# EAGLE design z80_test (EAGLE 6.5.0)
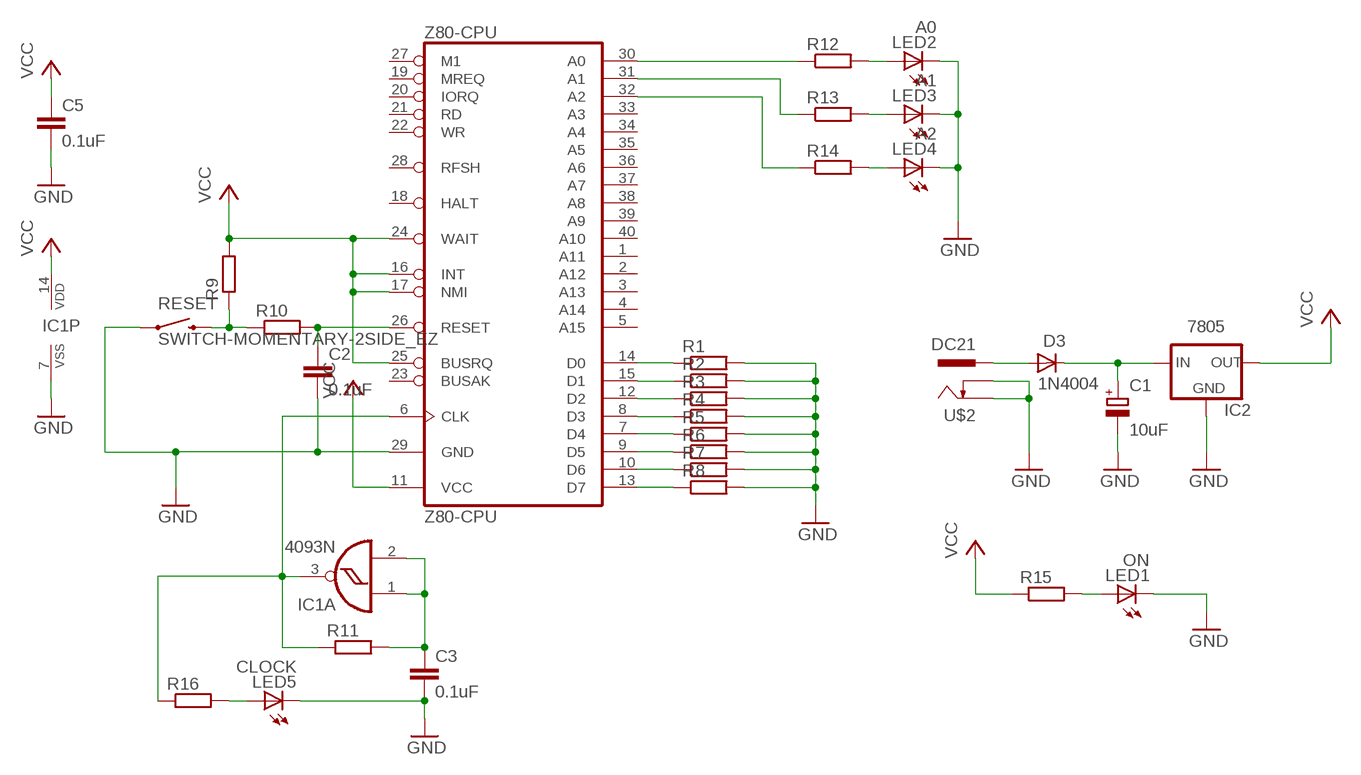
[diagram p0: schematic, sheet 1]

## Parts
C1  10uF  CPOL-EUE2,5-6E  [E2,5-6E]
C2  0.1uF  C-EU025-025X050  [C025-025X050]
C3  0.1uF  C-EU025-025X050  [C025-025X050]
C5  0.1uF  C-EU025-025X050  [C025-025X050]
D3  1N4004  [DO41-10]
IC1  4093N  [DIL14]
IC2  7805  78XXL  [78XXL]
LED1  ON  LED3MM  [LED3MM]
LED2  A0  LED3MM  [LED3MM]
LED3  A1  LED3MM  [LED3MM]
LED4  A2  LED3MM  [LED3MM]
LED5  CLOCK  LED3MM  [LED3MM]
R1  10K  R-EU_0204/7  [0204/7]
R2  10K  R-EU_0204/7  [0204/7]
R3  10K  R-EU_0204/7  [0204/7]
R4  10K  R-EU_0204/7  [0204/7]
R5  10K  R-EU_0204/7  [0204/7]
R6  10K  R-EU_0204/7  [0204/7]
R7  10K  R-EU_0204/7  [0204/7]
R8  10K  R-EU_0204/7  [0204/7]
R9  10K  R-EU_0204/7  [0204/7]
R10  330  R-EU_0204/7  [0204/7]
R11  68K  R-EU_0204/7  [0204/7]
R12  470  R-EU_0204/7  [0204/7]
R13  470  R-EU_0204/7  [0204/7]
R14  470  R-EU_0204/7  [0204/7]
R15  470  R-EU_0204/7  [0204/7]
R16  470  R-EU_0204/7  [0204/7]
RESET  SWITCH-MOMENTARY-2SIDE_EZ  [TACTILE-PTH-SIDEEZ]
U$2  DC21  [DCSKT]
Z80-CPU  Z80-CPU  Z80CPU  [DIL40]

## Nets
+VRAW [VCC]: C1.+ D3.C IC2.IN
GND [GND]: C1.- C2.2 C3.2 C5.2 IC1.7(P:VSS) IC2.GND LED1.K(C) LED2.K(C) LED3.K(C) LED4.K(C) LED5.K(C) R1.2 R2.2 R3.2 R4.2 R5.2 R6.2 R7.2 R8.2 RESET.1 U$2.2 U$2.3 Z80-CPU.29(GND)
N$1: R12.1 Z80-CPU.30(A0)
N$2: R13.1 Z80-CPU.31(A1)
N$3: R14.1 Z80-CPU.32(A2)
N$4: R1.1 Z80-CPU.14(D0)
N$5: R2.1 Z80-CPU.15(D1)
N$6: R3.1 Z80-CPU.12(D2)
N$7: R4.1 Z80-CPU.8(D3)
N$8: R5.1 Z80-CPU.7(D4)
N$9: R6.1 Z80-CPU.9(D5)
N$10: R7.1 Z80-CPU.10(D6)
N$11: R8.1 Z80-CPU.13(D7)
N$12 [VCC]: D3.A U$2.1
N$13: C2.1 R10.2 Z80-CPU.26(RESET)
N$14: R9.1 R10.1 RESET.2
N$15: IC1.3(A:O) R11.1 R16.1 Z80-CPU.6(CLK)
N$16: LED2.A R12.2
N$17: LED1.A R15.2
N$18: LED3.A R13.2
N$19 [GND]: C3.1 IC1.1(A:I0) IC1.2(A:I1) R11.2
N$20: LED4.A R14.2
N$21: LED5.A R16.2
VCC [VCC]: C5.1 IC1.14(P:VDD) IC2.OUT R9.2 R15.1 Z80-CPU.11(VCC) Z80-CPU.16(INT) Z80-CPU.17(NMI) Z80-CPU.24(WAIT) Z80-CPU.25(BUSRQ)
Unconnected: IC1.4(B:O) IC1.5(B:I0) IC1.6(B:I1) IC1.8(C:I0) IC1.9(C:I1) IC1.10(C:O) IC1.11(D:O) IC1.12(D:I0) IC1.13(D:I1) Z80-CPU.1(A11) Z80-CPU.2(A12) Z80-CPU.3(A13) Z80-CPU.4(A14) Z80-CPU.5(A15) Z80-CPU.18(HALT) Z80-CPU.19(MREQ) Z80-CPU.20(IORQ) Z80-CPU.21(RD) Z80-CPU.22(WR) Z80-CPU.23(BUSAK) Z80-CPU.27(M1) Z80-CPU.28(RFSH) Z80-CPU.33(A3) Z80-CPU.34(A4) Z80-CPU.35(A5) Z80-CPU.36(A6) Z80-CPU.37(A7) Z80-CPU.38(A8) Z80-CPU.39(A9) Z80-CPU.40(A10)

## Library data of the parts
C1 = rcl:CPOL-EU: POLARIZED CAPACITOR, European symbol
C2 C3 C5 = rcl:C-EU: CAPACITOR, European symbol
D3 = diode:1N4004: DIODE general purpose rectifier, 1 A
IC1 = 40xx:4093: Quad 2-input NAND schmitt trigger
IC2 = v-reg:78XXL: VOLTAGE REGULATOR
LED1-LED5 = led:LED: LED OSRAM: - CHIPLED LG R971, LG N971, LY N971, LG Q971, LY Q971, LO R971, LY R971 LH N974, LH R974 LS Q976, LO Q976, LY Q976 LO Q996 - Hyper CHIPLED LW Q18S LB Q993, LB Q99A, LB R99A - SideLED LS A670, LO A670, LY A670, LG A670, LP A670 LB A673, LV A673, LT A673, LW A673 LH A674 LY A675 LS A676, LA A676, LO A676, LY A676, LW A676 LS A679, LY A679, LG A679 - Hyper Micro SIDELED® LS Y876, LA Y876, LO Y876, LY Y876 LT Y87S - SmartLED LW L88C, LW L88S LB L89C, LB L89S, LG L890 LS L89K, LO L89K, LY L89K LS L896, LA L896, LO L896, LY L896 - TOPLED LS T670, LO T670, LY T670, LG T670, LP T670 LSG T670, LSP T670, LSY T670, LOP T670, LYG T670 LG T671, LOG T671, LSG T671 LB T673, LV T673, LT T673, LW T673 LH T674 LS T676, LA T676, LO T676, LY T676, LB T676, LH T676, LSB T676, LW T676 LB T67C, LV T67C, LT T67C, LS T67K, LO T67K, LY T67K, LW E67C LS E67B, LA E67B, LO E67B, LY E67B, LB E67C, LV E67C, LT E67C LW T67C LS T679, LY T679, LG T679 LS T770, LO T770, LY T770, LG T770, LP T770 LB T773, LV T773, LT T773, LW T773 LH T774 LS E675, LA E675, LY E675, LS T675 LS T776, LA T776, LO T776, LY T776, LB T776 LHGB T686 LT T68C, LB T68C - Hyper Mini TOPLED® LB M676 - Mini TOPLED Santana® LG M470 LS M47K, LO M47K, LY M47K Source: http://www.osram.convergy.de LUXEON: - LUMILED® LXK2-PW12-R00, LXK2-PW12-S00, LXK2-PW14-U00, LXK2-PW14-V00 LXK2-PM12-R00, LXK2-PM12-S00, LXK2-PM14-U00 LXK2-PE12-Q00, LXK2-PE12-R00, LXK2-PE12-S00, LXK2-PE14-T00, LXK2-PE14-U00 LXK2-PB12-K00, LXK2-PB12-L00, LXK2-PB12-M00, LXK2-PB14-N00, LXK2-PB14-P00, LXK2-PB14-Q00 LXK2-PR12-L00, LXK2-PR12-M00, LXK2-PR14-Q00, LXK2-PR14-R00 LXK2-PD12-Q00, LXK2-PD12-R00, LXK2-PD12-S00 LXK2-PH12-R00, LXK2-PH12-S00 LXK2-PL12-P00, LXK2-PL12-Q00, LXK2-PL12-R00 Source: www.luxeon.com KINGBRIGHT: KA-3528ASYC Source: www.kingbright.com
R1-R16 = rcl:R-EU_: RESISTOR, European symbol
RESET = SparkFun-Electromechanical:SWITCH-MOMENTARY-2: Various NO switches- pushbuttons, reed, etc
U$2 = dcsocket:DC21: DC 2.1 mm Power Socket Negative Centre
Z80-CPU = zilog:Z80CPU: Z80 FAMILY DEVICE

## Net classes
0 default: width 0.508 mm, drill 0.508 mm
1 VCC: width 1.016 mm, drill 0.508 mm
2 GND: width 1.016 mm, drill 0.508 mm

## Board
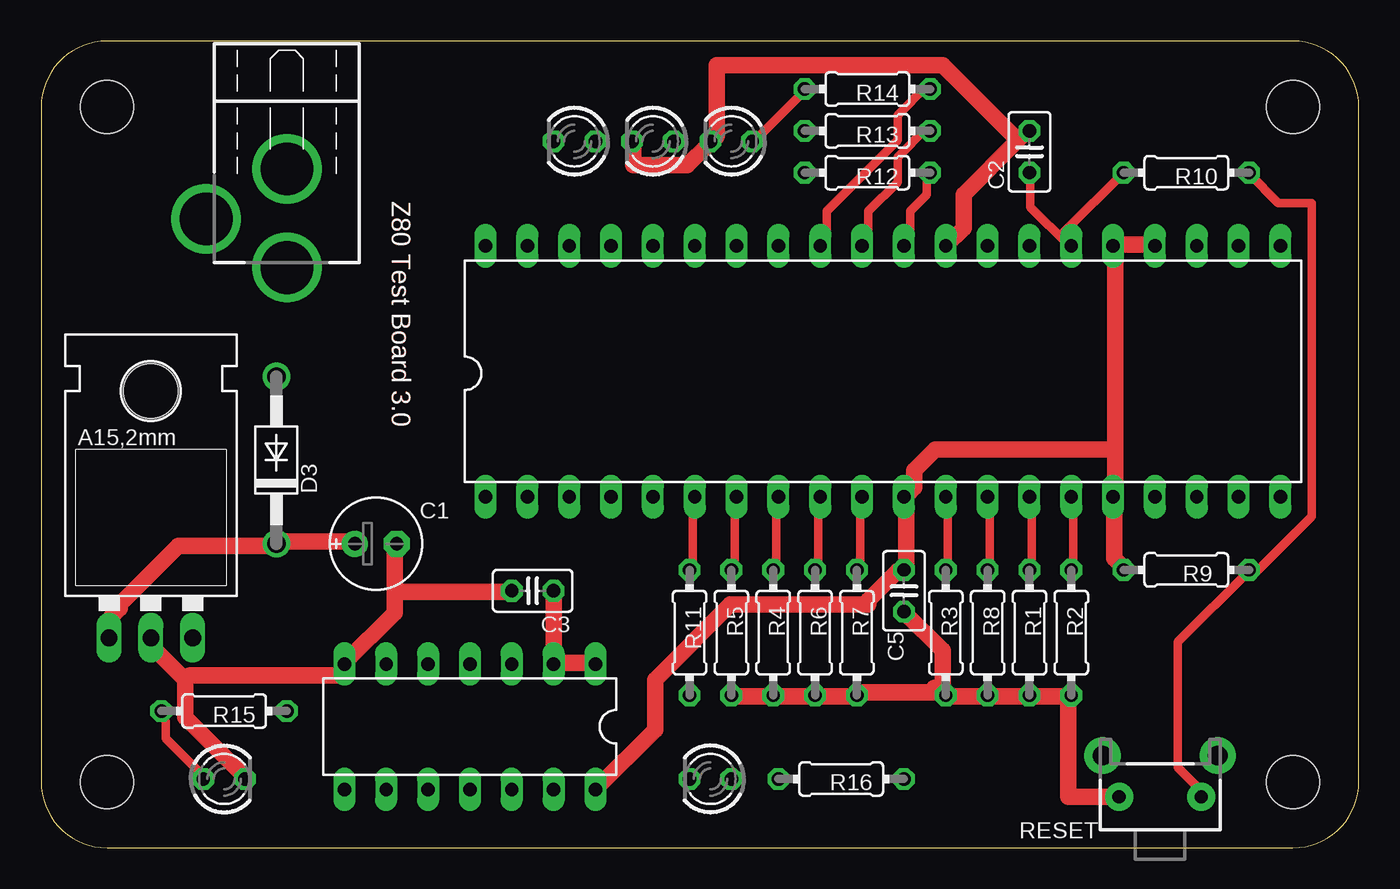
[diagram p1: board, top side]
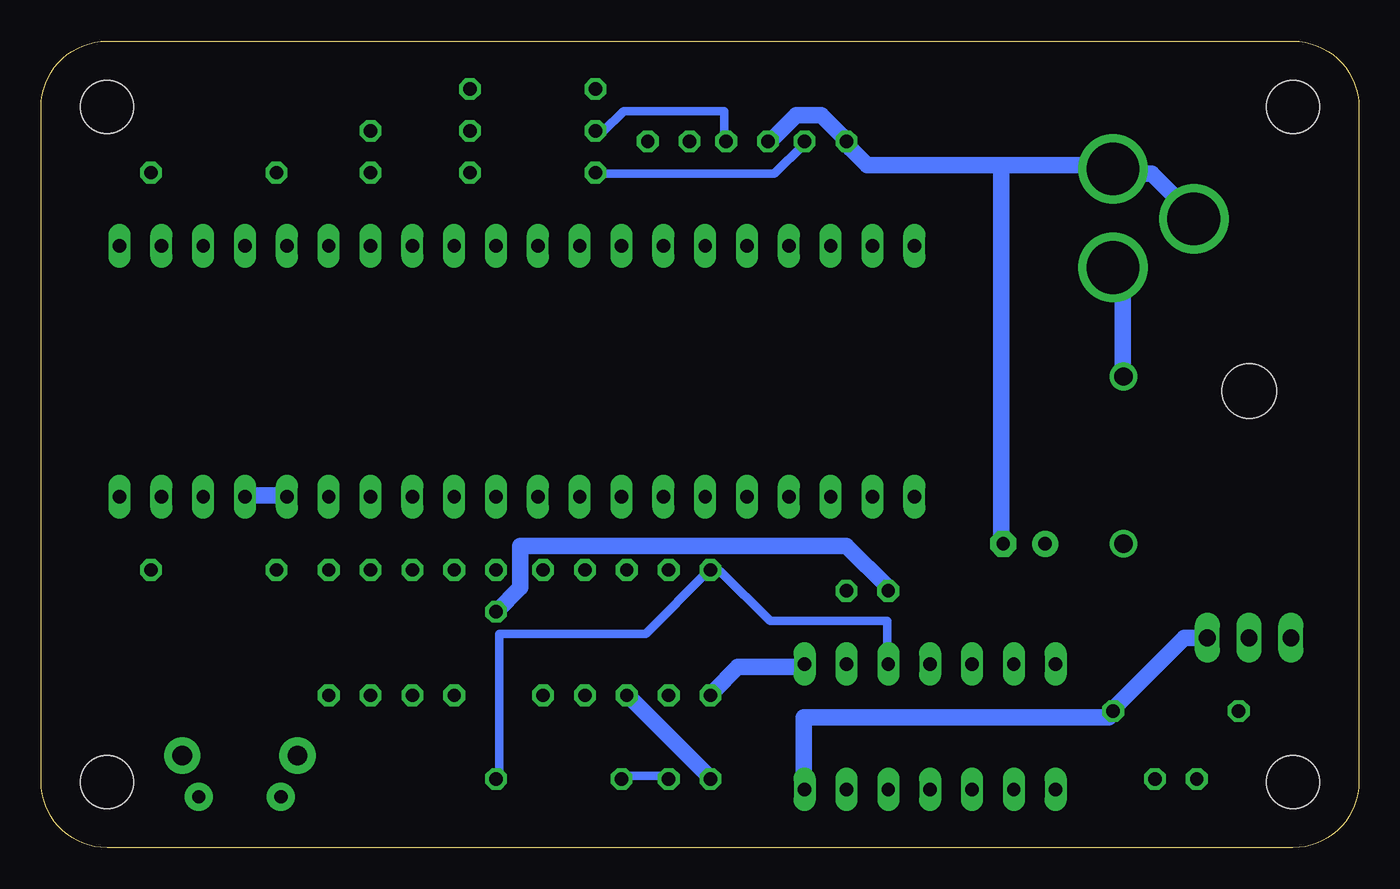
[diagram p2: board, bottom side, seen from below]

Size 80 x 49 mm. Coordinates in mm from the lower left corner, seen from the top.
Copper layers (1*16): Top 0.035mm / dielectric 1.5mm / Bottom 0.035mm
Design rules "default *": minimum track width 10mil, minimum drill 20mil, track to track 8mil, track to pad 8mil, pad to pad 8mil, via to via 8mil, smd to smd 8mil, copper to edge 8mil, drill to drill 8mil, minimum pad ring 10mil, minimum via ring 8mil, stop-mask expansion 4mil, vias tented up to drill 0mil, thermal gap 10mil

### Footprints (pad centres in the part's own frame; a part is rotated, then mirrored left to right if it is on the bottom)
E2,5-6E = drill 0.813 pad 1.575: + -1.27,0 | drill 0.813 pad 1.575 octagon: - 1.27,0
C025-025X050 = drill 0.813 octagon: 1 -1.27,0; 2 1.27,0
DO41-10 = drill 1.118: A 5.08,0; C -5.08,0
DIL14 = drill 0.813 long: 1 -7.62,-3.81; 2 -5.08,-3.81; 3 -2.54,-3.81; 4 0,-3.81; 5 2.54,-3.81; 6 5.08,-3.81; 7 7.62,-3.81; 8 7.62,3.81; 9 5.08,3.81; 10 2.54,3.81; 11 0,3.81; 12 -2.54,3.81; 13 -5.08,3.81; 14 -7.62,3.81
78XXL = drill 1.016 long: GND 0,-3.81; IN -2.54,-3.81; OUT 2.54,-3.81 | hole 3.302: 0,11.176
LED3MM = drill 0.813 octagon: A -1.27,0; K 1.27,0
0204/7 = drill 0.813 octagon: 1 -3.81,0; 2 3.81,0
TACTILE-PTH-SIDEEZ = drill 0.8 pad 1.7: 1 -2.5,0; 2 2.5,0 | drill 1.2 pad 2.2: ANCHOR1 -3.5,2.5; ANCHOR2 3.5,2.5
DP8049_V1 = hole 3.2: -36,-20.5; 36,-20.5; 36,20.5; -36,20.5
DCSKT = drill 3.2: 1 0,6.08; 2 0,0.08; 3 4.9,3.13
DIL40 = drill 0.813 long: 1 -24.13,-7.62; 2 -21.59,-7.62; 3 -19.05,-7.62; 4 -16.51,-7.62; 5 -13.97,-7.62; 6 -11.43,-7.62; 7 -8.89,-7.62; 8 -6.35,-7.62; 9 -3.81,-7.62; 10 -1.27,-7.62; 11 1.27,-7.62; 12 3.81,-7.62; 13 6.35,-7.62; 14 8.89,-7.62; 15 11.43,-7.62; 16 13.97,-7.62; 17 16.51,-7.62; 18 19.05,-7.62; 19 21.59,-7.62; 20 24.13,-7.62; 21 24.13,7.62; 22 21.59,7.62; 23 19.05,7.62; 24 16.51,7.62; 25 13.97,7.62; 26 11.43,7.62; 27 8.89,7.62; 28 6.35,7.62; 29 3.81,7.62; 30 1.27,7.62; 31 -1.27,7.62; 32 -3.81,7.62; 33 -6.35,7.62; 34 -8.89,7.62; 35 -11.43,7.62; 36 -13.97,7.62; 37 -16.51,7.62; 38 -19.05,7.62; 39 -21.59,7.62; 40 -24.13,7.62

### Placement (x,y rotation side)
C1  20.31,18.47 0 top
C2  60,42.28 90 top
C3  29.84,15.61 180 top
C5  52.38,15.61 270 top
D3  14.28,23.55 90 top
IC1  26.03,7.35 180 top
IC2  6.66,16.56 0 top
LED1  11.11,4.18 0 top
LED2  32.38,42.91 180 top
LED3  37.14,42.91 180 top
LED4  41.91,42.91 180 top
LED5  40.63,4.18 180 top
R1  60,13.07 270 top
R2  62.54,13.07 270 top
R3  54.92,13.07 270 top
R4  44.45,13.07 270 top
R5  41.91,13.07 270 top
R6  46.98,13.07 270 top
R7  49.52,13.07 270 top
R8  57.46,13.07 270 top
R9  69.53,16.88 180 top
R10  69.53,41.01 180 top
R11  39.37,13.07 270 top
R12  50.16,41.01 180 top
R13  50.16,43.55 180 top
R14  50.16,46.09 180 top
R15  11.11,8.31 180 top
R16  48.57,4.18 180 top
RESET  67.94,3.1 0 top
U$1  [DP8049_V1]  40,24.5 0 top
U$2  14.92,41.33 180 top
Z80-CPU  51.11,28.95 0 top

### Tracks (layer width: path | path; a pad name or v marks a point on that pad's centre or on a via)
+VRAW
  Top 1.016: IC2.IN 4.25,12.75 4.25,14.02 4.76,14.53 4.76,14.78 8.31,18.34 14.16,18.34 D3.C 14.66,18.59 18.98,18.59 C1.+
GND
  Top 1.016: 54.99,36.63 Z80-CPU.29 56,37.64 56,39.68 59.3,42.98 | 59.3,42.98 59.81,43.49 C2.2 | LED3.K 35.94,42.72 35.94,41.45 39.24,41.45 40.51,42.72 LED4.K 41.02,43.23 41.02,47.55 54.73,47.55 59.3,42.98 | R5.2 42.03,9.2 44.32,9.2 R4.2 44.83,9.2 46.86,9.2 R6.2 47.37,9.2 49.4,9.2 R7.2 49.91,9.45 54.22,9.45 54.22,9.7 54.73,9.7 | C5.2 54.73,11.99 54.73,9.7 | 54.73,9.7 R3.2 54.99,9.2 57.27,9.2 R8.2 57.78,9.2 59.81,9.2 R1.2 60.32,9.2 62.35,9.2 R2.2 62.35,8.69 62.35,3.1 RESET.1 | 8.76,10.21 8.76,7.93 12.31,4.37 LED1.K | 8.76,10.21 6.73,12.24 6.73,12.75 IC2.GND | 21.46,15.55 21.46,18.34 C1.- | 21.46,15.55 21.46,14.28 18.41,11.23 IC1.7 18.16,10.72 18.16,10.47 9.01,10.47 8.76,10.21 | 21.46,15.55 28.57,15.55 C3.2
  Bottom 1.016: LED3.K 35.68,42.98 34.16,44.5 32.63,44.5 31.11,42.98 LED2.K 30.86,42.47 29.84,41.45 21.71,41.45 | 21.71,41.45 15.11,41.45 U$2.2 14.6,40.95 12.57,40.95 10.03,38.41 U$2.3 | C5.2 50.92,15.8 50.92,18.34 31.11,18.34 28.57,15.8 C3.2 | 21.71,41.45 21.71,18.59 C1.- | LED5.K 39.49,4.37 44.32,9.2 R4.2
N$1
  Top 0.508: Z80-CPU.30 52.51,36.63 52.76,36.88 52.76,38.66 53.78,39.68 53.78,40.95 R12.1
N$2
  Top 0.508: Z80-CPU.31 49.97,36.63 50.22,36.88 50.22,38.66 52,40.44 52,41.96 53.78,43.74 R13.1
N$3
  Top 0.508: Z80-CPU.32 47.43,36.63 47.68,36.88 47.68,38.66 52,42.98 52,44.5 53.78,46.28 R14.1
N$4
  Top 0.508: R1.1 60.13,17.07 60.13,21.13 Z80-CPU.14
N$5
  Top 0.508: R2.1 62.67,17.07 62.67,21.13 Z80-CPU.15
N$6
  Top 0.508: R3.1 55.05,17.07 55.05,21.13 Z80-CPU.12
N$7
  Top 0.508: R4.1 44.64,17.07 44.64,21.13 Z80-CPU.8
N$8
  Top 0.508: R5.1 42.1,17.07 42.1,21.13 Z80-CPU.7
N$9
  Top 0.508: R6.1 47.18,17.07 47.18,21.13 Z80-CPU.9
N$10
  Top 0.508: R7.1 49.71,17.07 49.71,21.13 Z80-CPU.10
N$11
  Top 0.508: R8.1 57.59,17.07 57.59,21.13 Z80-CPU.13
N$12
  Bottom 1.016: D3.A 14.35,28.75 14.35,35.1 14.85,35.1 U$2.1
N$13
  Top 0.508: C2.1 60.07,40.95 60.07,38.91 62.35,36.63 Z80-CPU.26 62.1,37.14 62.1,37.39 R10.2
N$14
  Top 0.508: 73.34,16.82 69.02,12.5 69.02,4.88 70.29,3.61 70.29,3.1 RESET.2 | 73.34,16.82 73.85,16.82 77.15,20.12 77.15,39.17 75.11,39.17 73.34,40.95 R10.1 | 73.34,16.82 R9.1
N$15
  Top 0.508: Z80-CPU.6 39.56,21.13 39.56,17.07 R11.1
  Bottom 0.508: IC1.3 28.63,11.23 28.63,13.77 35.75,13.77 38.79,16.82 39.3,16.82 R11.1 39.49,16.82 43.3,13.01 52.19,13.01 52.19,4.37 R16.1
N$16
  Bottom 0.508: LED2.A 33.71,42.72 35.49,40.95 46.16,40.95 R12.2
N$17
  Top 0.508: R15.2 7.3,7.93 7.55,7.67 7.55,6.66 9.84,4.37 LED1.A
N$18
  Bottom 0.508: LED3.A 38.54,42.98 38.54,44.76 44.64,44.76 45.91,43.49 46.16,43.49 R13.2
N$19
  Top 1.016: IC1.1 33.65,11.23 31.11,11.23 IC1.2 C3.1
  Bottom 1.016: R11.2 39.24,9.45 37.71,10.97 33.65,10.97 IC1.1
N$20
  Top 0.508: LED4.A 43.37,42.98 46.16,45.77 46.16,46.03 R14.2
N$21
  Bottom 0.508: LED5.A 42.03,4.37 44.57,4.37 R16.2
VCC
  Top 1.016: Z80-CPU.24 67.5,36.63 65.21,36.63 Z80-CPU.25 65.21,36.12 65.21,24.18 | 65.21,24.18 65.21,21.39 Z80-CPU.16 65.15,20.88 65.15,17.58 65.65,17.07 R9.2 | 65.21,24.18 54.29,24.18 53.02,22.91 53.02,21.9 52.76,21.64 Z80-CPU.11 52.51,21.13 52.51,17.07 C5.1 52,16.82 50.22,15.04 50.22,14.78 41.84,14.78 37.27,10.21 37.27,7.16 IC1.14
  Bottom 1.016: IC2.OUT 10.6,12.75 14.92,8.43 R15.1 15.17,7.93 33.71,7.93 33.71,3.61 IC1.14 | Z80-CPU.16 65.21,21.39 67.5,21.39 Z80-CPU.17

### Text on the board
Top: Z80 Test Board 3.0
tNames: Z80 Test Board 3.0